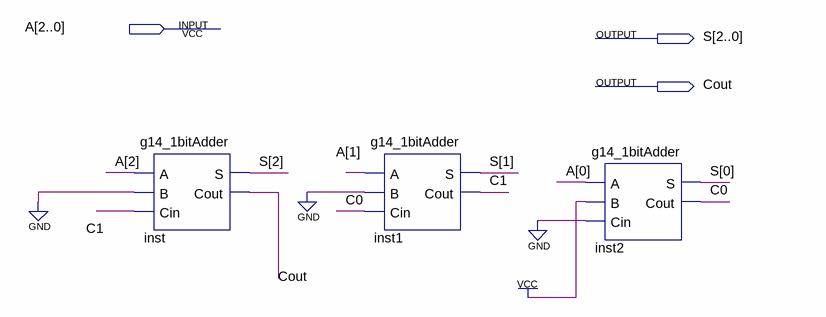
[diagram p0: schematic sheet]
// Quartus schematic g14_3bitadder.bdf as structural Verilog: 3 symbols, 3 pins
module g14_3bitadder (
  input  [2:0] A,
  output [2:0] S,
  output Cout
);

  wire C0, C1;

  g14_1bitAdder inst (.A(A[2]), .B(1'b0), .Cin(C1), .S(S[2]), .Cout(Cout));
  g14_1bitAdder inst1 (.A(A[1]), .B(1'b0), .Cin(C0), .S(S[1]), .Cout(C1));
  g14_1bitAdder inst2 (.A(A[0]), .B(1'b1), .Cin(1'b0), .S(S[0]), .Cout(C0));
endmodule
